# Altium schematic sheet Power.SchDoc
size A4; SheetNumber: 1; SheetTotal: 1
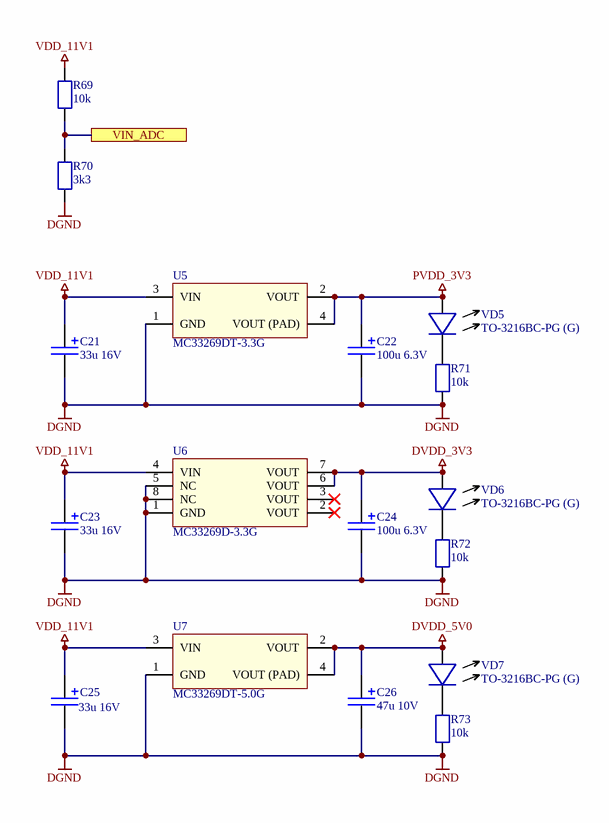
[diagram p0: Power.SchDoc]

## Parts
C21  33u 16V  [TECAP_TYPE_B]
C22  100u 6.3V  [TECAP_TYPE_B]
C23  33u 16V  [TECAP_TYPE_B]
C24  100u 6.3V  [TECAP_TYPE_B]
C25  33u 16V  [TECAP_TYPE_B]
C26  47u 10V  [TECAP_TYPE_B]
R69  10k  [R_0603/1608]
R70  3k3  [R_0603/1608]
R71  10k  [R_0603/1608]
R72  10k  [R_0603/1608]
R73  10k  [R_0603/1608]
U5  MC33269DT-3.3G  [TO252AA/DPAK]
U6  MC33269D-3.3G  [SO8_1.27]
U7  MC33269DT-5.0G  [TO252AA/DPAK]
VD5  TO-3216BC-PG (G)  [LED_0603/1608]
VD6  TO-3216BC-PG (G)  [LED_0603/1608]
VD7  TO-3216BC-PG (G)  [LED_0603/1608]

## Ports
VIN_ADC

## Nets
DGND: C21.2(NEG) C22.2(NEG) C23.2(NEG) C24.2(NEG) C25.2(NEG) C26.2(NEG) R70.1 R71.1 R72.1 R73.1 U5.1(GND) U6.1(GND) U6.5(NC) U6.8(NC) U7.1(GND)
DVDD_3V3: C24.1(POS) U6.6(VOUT) U6.7(VOUT) VD6.A
DVDD_5V0: C26.1(POS) U7.2(VOUT) U7.4(VOUT_(PAD)) VD7.A
PVDD_3V3: C22.1(POS) U5.2(VOUT) U5.4(VOUT_(PAD)) VD5.A
VDD_11V1: C21.1(POS) C23.1(POS) C25.1(POS) R69.2 U5.3(VIN) U6.4(VIN) U7.3(VIN)
VIN_ADC: R69.1 R70.2 ; port VIN_ADC
NetR71_2: R71.2 VD5.C
NetR72_2: R72.2 VD6.C
NetR73_2: R73.2 VD7.C

Not connected (* = marked no-connect by the designer): U6 2(VOUT)* 3(VOUT)*

## Library data of the parts
C21-C26 = Capacitor polar: Polarized capacitor
R69-R73 = Resistor
U5 U7 = MC33269DT: LDO voltage regulator; pin to pad: 2>3 3>2 4>3
U6 = MC33269D: LDO voltage regulator
VD5-VD7 = LED